# Altium schematic sheet ESIMA E-Meter_CPU_Peripherals.SchDoc: Esima CPU Peripherals
size A3; DrawnBy: Jürgen Merz; Address1: Wilhelm- Schickard- Strasse 10; Address2: 78052 Villingen Schwenningen; Address3: juergen.merz@hsg-imit.de; Address4: Tel. +49 7721 943 138; PhoneNumber: +49 7721 943 138; FaxNumber: +49 7721 943 140
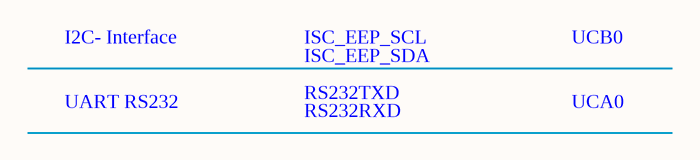
[diagram p0: ESIMA E-Meter_CPU_Peripherals.SchDoc]

## Notes on the sheet
- I2C- Interface
- ISC_EEP_SCL
- ISC_EEP_SDA
- UCB0
- UART RS232
- RS232TXD
- RS232RXD
- UCA0
- Title
- Size:
- Date:
- A3
- Number:
- Time:
- Revision:
- Sheet
- of
- File: